# Altium schematic sheet magnetometer.SchDoc
size A4
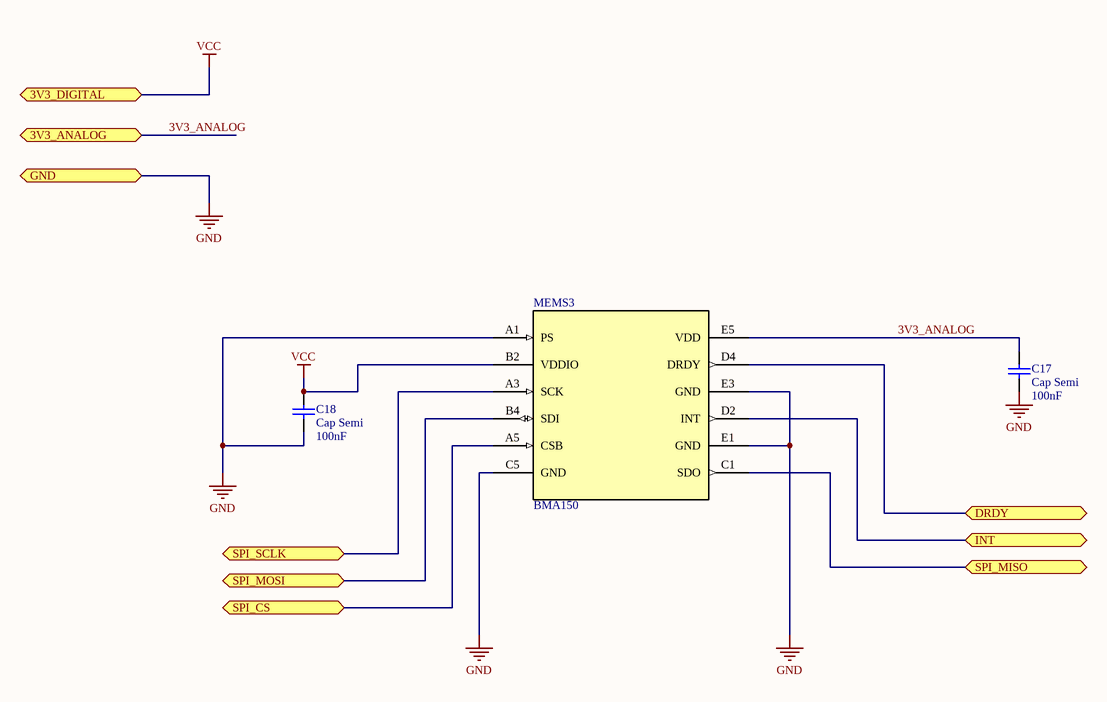
[diagram p0: magnetometer.SchDoc]

## Parts
C17  Cap Semi  value 100nF  [C1206]
C18  Cap Semi  value 100nF  [C1206]
MEMS3  BMA150  [BGA12-BOSCH]

## Ports
3V3_ANALOG, 3V3_DIGITAL, DRDY, GND, INT, SPI_CS, SPI_MISO, SPI_MOSI, SPI_SCLK

## Nets
GND: C17.1 C18.1 MEMS3.A1(PS) MEMS3.C5(GND) MEMS3.E1(GND) MEMS3.E3(GND) ; port GND
VCC: C18.2 MEMS3.B2(VDDIO) ; port 3V3_DIGITAL
3V3_ANALOG: C17.2 MEMS3.E5(VDD) ; port 3V3_ANALOG
DRDY: MEMS3.D4(DRDY) ; port DRDY
INT: MEMS3.D2(INT) ; port INT
SPI_CS: MEMS3.A5(CSB) ; port SPI_CS
SPI_MISO: MEMS3.C1(SDO) ; port SPI_MISO
SPI_MOSI: MEMS3.B4(SDI) ; port SPI_MOSI
SPI_SCLK: MEMS3.A3(SCK) ; port SPI_SCLK

## Library data of the parts
C17 C18 = Cap Semi: Capacitor (Semiconductor SIM Model); Published: 8-Jun-2000; LatestRevisionDate: 29-May-2009; LatestRevisionNote: IPC-7351 Footprint Added.; PackageReference: C1206; Publisher: Altium Limited; PackageDescription: Chip Capacitor